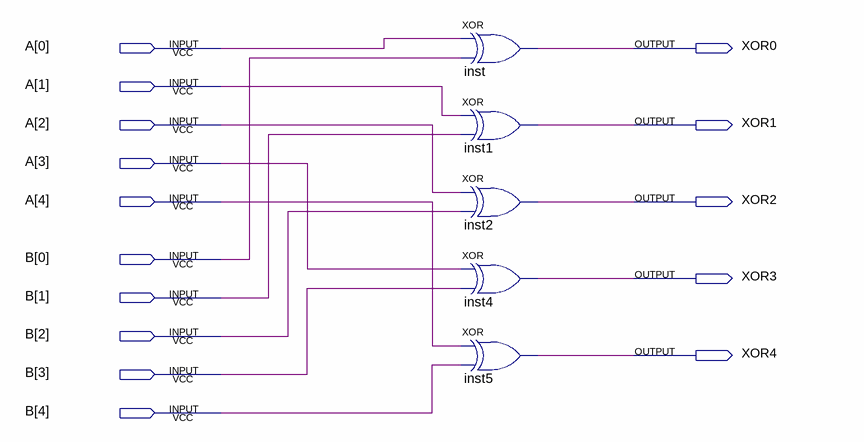
[diagram p0: schematic sheet]
// Quartus schematic AXORB.bdf as structural Verilog: 5 symbols, 15 pins
module AXORB (
  input  [4:0] A,
  input  [4:0] B,
  output XOR0,
  output XOR1,
  output XOR2,
  output XOR3,
  output XOR4
);

  xor inst (XOR0, A[0], B[0]);
  xor inst1 (XOR1, A[1], B[1]);
  xor inst2 (XOR2, A[2], B[2]);
  xor inst4 (XOR3, A[3], B[3]);
  xor inst5 (XOR4, A[4], B[4]);
endmodule
